# EAGLE schematic iofresh (EAGLE 9.6.2)
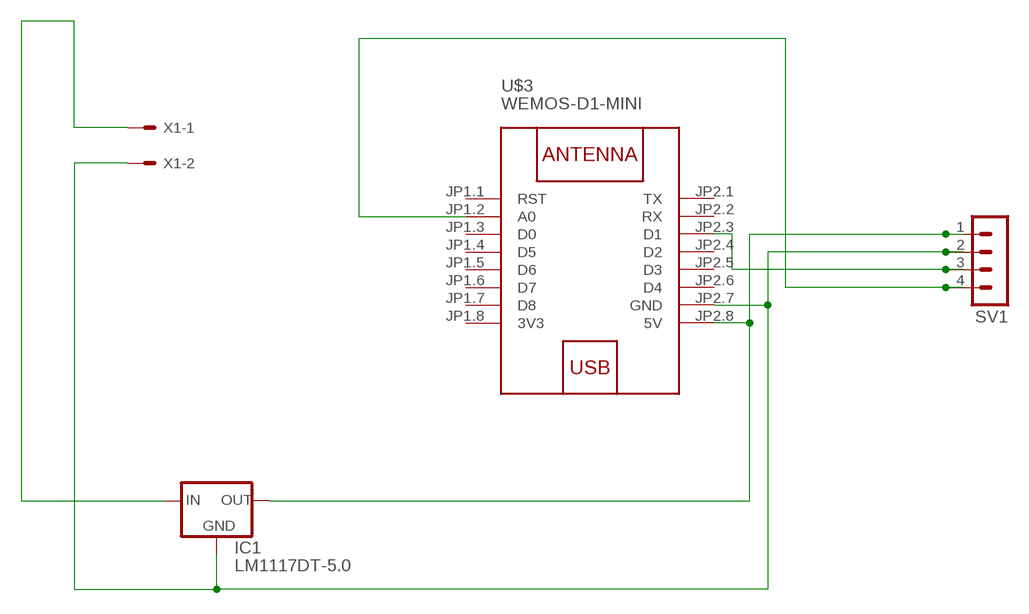
[diagram p0: schematic, sheet 1]

## Parts
IC1  LM1117DT-5.0  [TO252]
SV1  MA04-1  [MA04-1]
U$3  WEMOS-D1-MINI  [WEMOS-D1-MINI]
X1  KK-156-2  [KK-156-2]

## Nets
N$1: IC1.2(IN) X1.1
N$2: IC1.3(OUT) SV1.1 U$3.JP2.8(5V)
N$3: IC1.1(GND) SV1.2 U$3.JP2.7(GND) X1.2
N$4: SV1.3 U$3.JP2.3(D1)
N$5: SV1.4 U$3.JP1.2(A0)
Unconnected: U$3.JP1.1(RST) U$3.JP1.3(D0) U$3.JP1.4(D5) U$3.JP1.5(D6) U$3.JP1.6(D7) U$3.JP1.7(D8) U$3.JP2.1(TX) U$3.JP2.2(RX) U$3.JP2.4(D2) U$3.JP2.5(D3) U$3.JP2.6(D4)

## Power pins joined to a net without a drawn wire
3V3: U$3.JP1.8(3V3)

## Library data of the parts
IC1 = lm1117_10:LM1117?-*: 800mA Low-Dropout Linear Regulator Source: http://www.ti.com/lit/ds/symlink/lm1117-n.pdf; MF: Texas Instruments; MPN: LM1117DT-5.0; OC_FARNELL: 9486283; OC_NEWARK: 41K3431
SV1 = con-lstb:MA04-1: PIN HEADER; OC_FARNELL: unknown; OC_NEWARK: unknown
U$3 = diy-modules:WEMOS-D1-MINI: WEMOS D1 mini: Mini Wi-Fi Board based on ESP-8266 device More details can be found here: https://www.wemos.cc/product/d1-mini.html Click here to find device on ebay.com <http://www.ebay.com/sch/wemos+d1+mini+nodemcu>
X1 = con-molex:KK-156-2: KK 156 HEADER Source: http://www.molex.com/pdm_docs/sd/026604100_sd.pdf; MF: MOLEX; OC_FARNELL: unknown; OC_NEWARK: unknown